# EAGLE design e-programmer-alt (EAGLE 6.1)
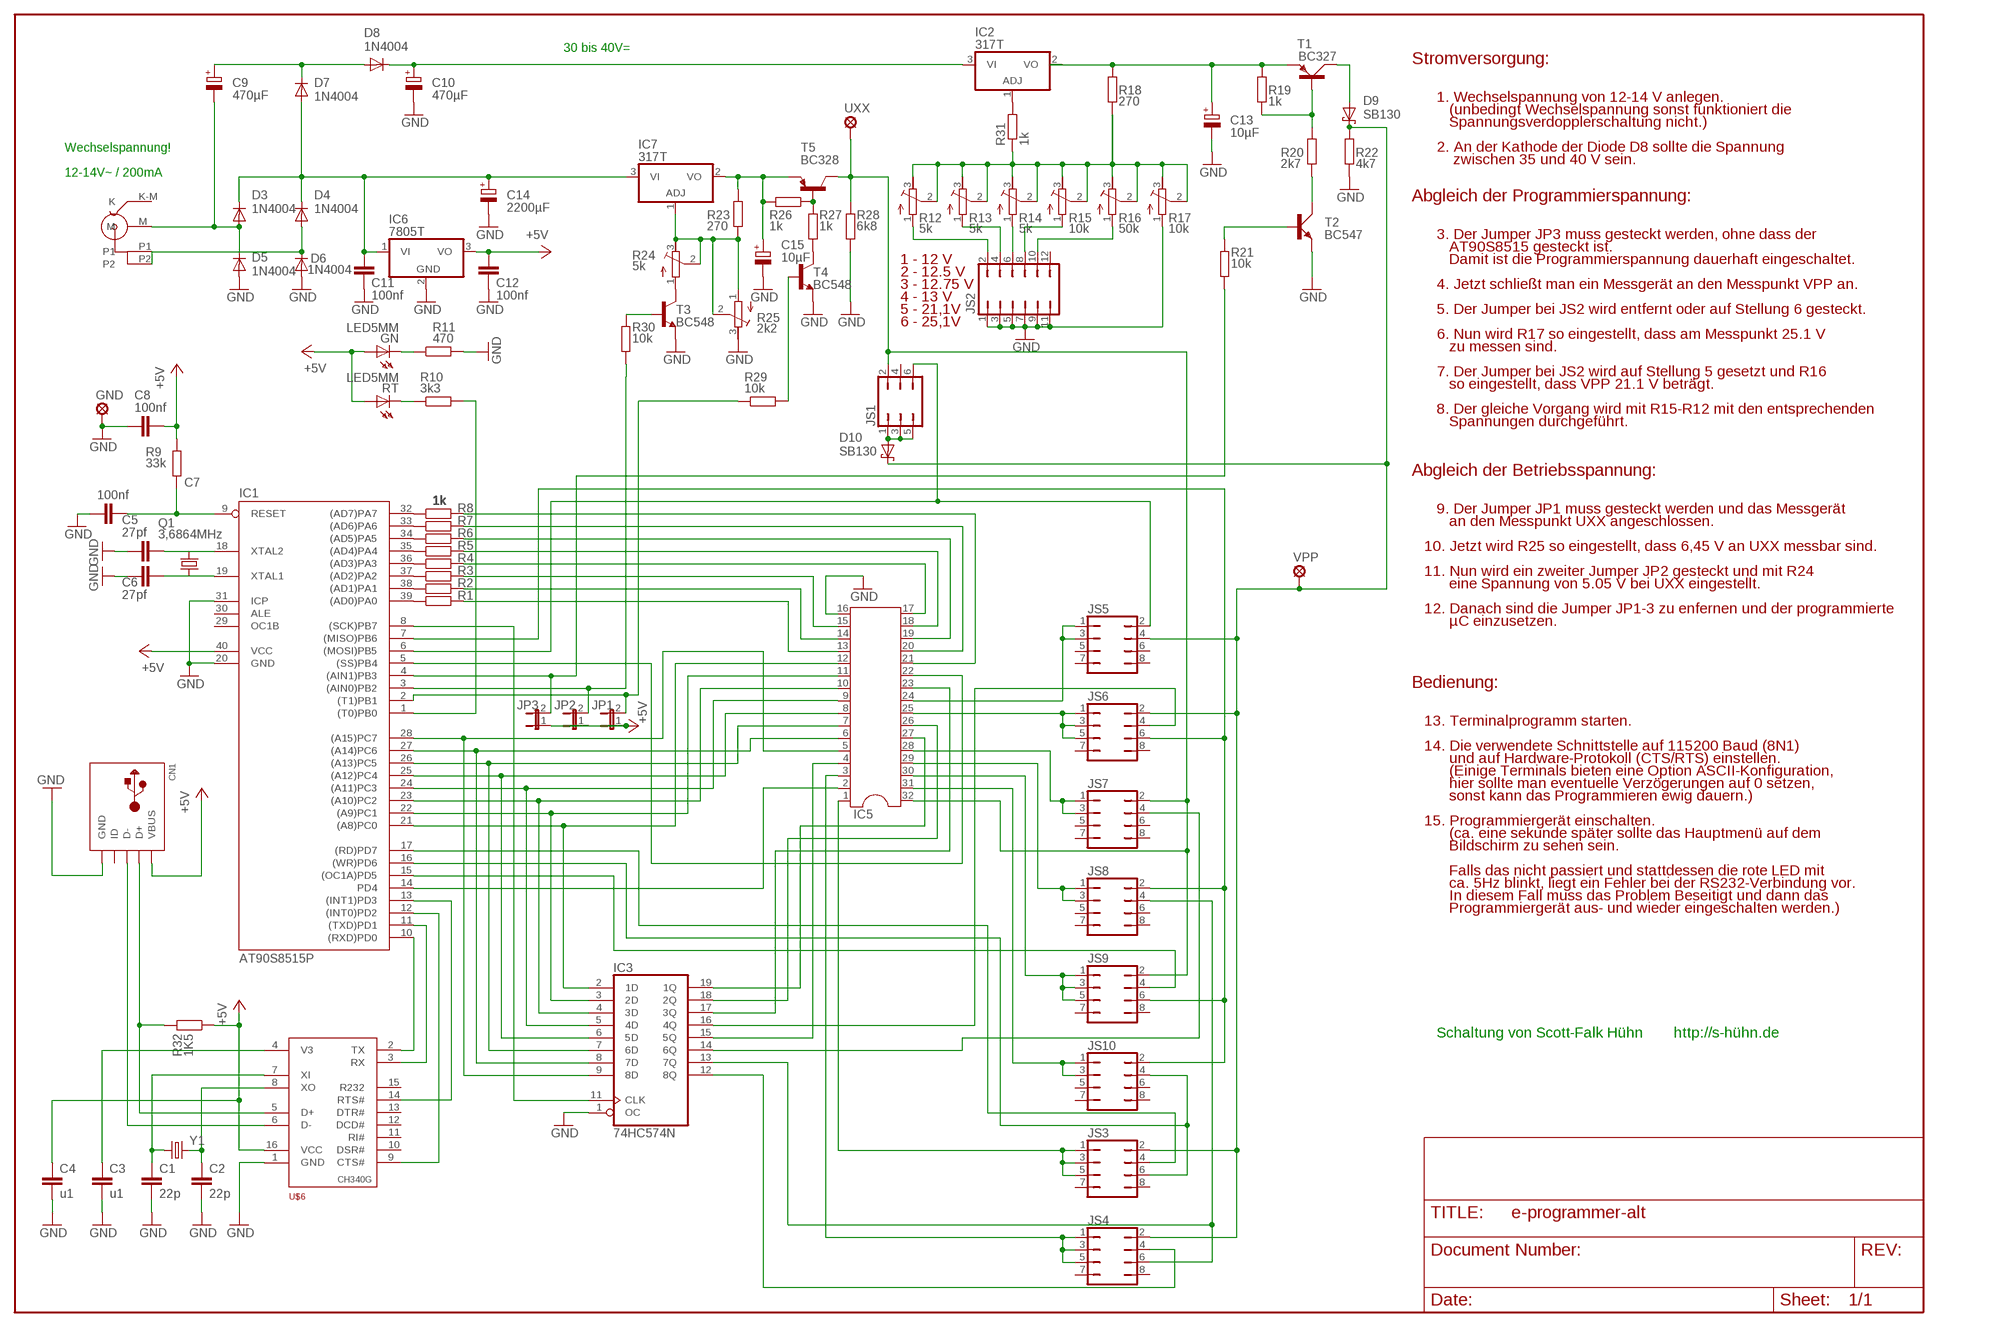
[diagram p0: schematic, sheet 1]

## Parts
BU1  KLIN_BU  [KLIN_BU]
C1  22p  C-EU025-025X050  [C025-025X050]
C2  22p  C-EU025-025X050  [C025-025X050]
C3  u1  C-EU025-025X050  [C025-025X050]
C4  u1  C-EU025-025X050  [C025-025X050]
C5  27pf  C-EU025-024X044  [C025-024X044]
C6  27pf  C-EU025-024X044  [C025-024X044]
C7  100nf  C-EU025-024X044  [C025-024X044]
C8  100nf  C-EU025-024X044  [C025-024X044]
C9  470µF  CPOL-EUE3.5-10  [E3,5-10]
C10  470µF  CPOL-EUE5-13  [E5-13]
C11  100nf  C-EU025-024X044  [C025-024X044]
C12  100nf  C-EU025-024X044  [C025-024X044]
C13  10µF  CPOL-EUE2.5-5  [E2,5-5]
C14  2200µF  CPOL-EUE7.5-16  [E7,5-16]
C15  10µF  CPOL-EUE5-5  [E5-5]
CN1  USBTHM  [USB-MINIB-THM]
D3  1N4004  [DO41-10]
D4  1N4004  [DO41-10]
D5  1N4004  [DO41-10]
D6  1N4004  [DO41-10]
D7  1N4004  [DO41-10]
D8  1N4004  [DO41-10]
D9  SB130  SCHOTTKY-DIODEDO35-7  [DO35-7]
D10  SB130  SCHOTTKY-DIODEDO35-7  [DO35-7]
GN  LED5MM  [LED5MM]
GND  LSP10  [LSP10]
IC1  AT90S8515P  [DIL40]
IC2  317T  [TO220H]
IC3  74HC574N  [DIL20]
IC5  DIL32  [DIL32]
IC6  7805T  [TO220H]
IC7  317T  [TO220H]
JP1  JP1E  [JP1]
JP2  JP1E  [JP1]
JP3  JP1E  [JP1]
JS1  JP3Q  [JP3Q]
JS2  JP6Q  [JP6Q]
JS3  JP4Q  [JP4Q]
JS4  JP4Q  [JP4Q]
JS5  JP4Q  [JP4Q]
JS6  JP4Q  [JP4Q]
JS7  JP4Q  [JP4Q]
JS8  JP4Q  [JP4Q]
JS9  JP4Q  [JP4Q]
JS10  JP4Q  [JP4Q]
Q1  3,6864MHz  HC49U-V  [HC49U-V]
R1  1k  R-EU_0207/7  [0207/7]
R2  1k  R-EU_0207/7  [0207/7]
R3  1k  R-EU_0207/7  [0207/7]
R4  1k  R-EU_0207/7  [0207/7]
R5  1k  R-EU_0207/7  [0207/7]
R6  1k  R-EU_0207/7  [0207/7]
R7  1k  R-EU_0207/7  [0207/7]
R8  1k  R-EU_0207/7  [0207/7]
R9  33k  R-EU_0204/7  [0204/7]
R10  3k3  R-EU_0204/7  [0204/7]
R11  470  R-EU_0204/7  [0204/7]
R12  5k  R-TRIMM3296Y  [RTRIM3296Y]
R13  5k  R-TRIMM3296Y  [RTRIM3296Y]
R14  5k  R-TRIMM3296Y  [RTRIM3296Y]
R15  10k  R-TRIMM3296Y  [RTRIM3296Y]
R16  50k  R-TRIMM3296Y  [RTRIM3296Y]
R17  10k  R-TRIMM3296Y  [RTRIM3296Y]
R18  270  R-EU_0207/7  [0207/7]
R19  1k  R-EU_0207/7  [0207/7]
R20  2k7  R-EU_0207/7  [0207/7]
R21  10k  R-EU_0207/7  [0207/7]
R22  4k7  R-EU_0207/7  [0207/7]
R23  270  R-EU_0207/7  [0207/7]
R24  5k  R-TRIMM3296Y  [RTRIM3296Y]
R25  2k2  R-TRIMM3296Y  [RTRIM3296Y]
R26  1k  R-EU_0207/7  [0207/7]
R27  1k  R-EU_0207/7  [0207/7]
R28  6k8  R-EU_0207/7  [0207/7]
R29  10k  R-EU_0207/7  [0207/7]
R30  10k  R-EU_0207/7  [0207/7]
R31  1k  R-EU_0207/7  [0207/7]
R32  1K5  R-EU_0204/7  [0204/7]
RT  LED5MM  [LED5MM]
T1  BC327  [SOT54A]
T2  BC547  [SOT54A]
T3  BC548  BC547  [TO92]
T4  BC548  BC547  [TO92]
T5  BC328  BC327  [TO92]
U$6  CH340G  [SO16]
UXX  LSP10  [LSP10]
VPP  LSP10  [LSP10]
Y1  CRYSTALHC49US  [HC49US]

## Nets
!CE: IC1.5((SS)PB4) IC5.22
!OE: IC1.6((MOSI)PB5) JS1.6 JS5.2
!PR: IC1.7((MISO)PB6) JS6.6 JS8.2 JS9.6 JS10.2
+5V: C4.1 C8.2 C12.1 CN1.VBUS GN.A IC1.40(VCC) IC6.3(VO) JP1.1 JP2.1 JP3.1 R9.2 R32.1 RT.A U$6.16(VCC)
A0: IC1.21((A8)PC0) IC3.2(1D) IC5.12
A1: IC1.22((A9)PC1) IC3.3(2D) IC5.11
A2: IC1.23((A10)PC2) IC3.4(3D) IC5.10
A3: IC1.24((A11)PC3) IC3.5(4D) IC5.9
A4: IC1.25((A12)PC4) IC3.6(5D) IC5.8
A5: IC1.26((A13)PC5) IC3.7(6D) IC5.7
A6: IC1.27((A14)PC6) IC3.8(7D) IC5.6
A7: IC1.28((A15)PC7) IC3.9(8D) IC5.5
A8: IC3.19(1Q) IC5.27
A9: IC3.18(2Q) IC5.26
A10: IC3.17(3Q) IC5.23
A11: IC3.16(4Q) JS6.4
A12: IC3.15(5Q) IC5.4
A13: IC3.14(6Q) JS7.4
A14: IC3.13(7Q) JS4.6 JS8.4
A15: IC3.12(8Q) JS4.4
A16: IC1.14(PD4) IC5.2
A17: IC1.15((OC1A)PD5) JS9.4
A18: IC1.16((WR)PD6) JS3.6 JS10.4
A19: IC1.17((RD)PD7) JS3.4
CTS: IC1.12((INT0)PD2) U$6.9(CTS#)
D0: IC5.13 R1.2
D1: IC5.14 R2.2
D2: IC5.15 R3.2
D3: IC5.17 R4.2
D4: IC5.18 R5.2
D5: IC5.19 R6.2
D6: IC5.20 R7.2
D7: IC5.21 R8.2
GND: C1.2 C2.2 C3.2 C4.2 C5.1 C6.1 C7.1 C8.1 C10.- C11.2 C12.2 C13.- C14.- C15.- CN1.GND D5.A D6.A GND.MP IC1.20(GND) IC1.31(ICP) IC3.1(OC) IC5.16 IC6.2(GND) JS2.1 JS2.3 JS2.5 JS2.7 JS2.9 JS2.11 R11.2 R17.1(E) R22.1 R25.3(A) R28.1 T2.E T3.1(E) T4.1(E) U$6.1(GND)
N$1: IC1.32((AD7)PA7) R8.1
N$2: IC1.33((AD6)PA6) R7.1
N$3: IC1.34((AD5)PA5) R6.1
N$4: IC1.35((AD4)PA4) R5.1
N$5: IC1.36((AD3)PA3) R4.1
N$6: IC1.37((AD2)PA2) R3.1
N$7: IC1.38((AD1)PA1) R2.1
N$8: IC1.39((AD0)PA0) R1.1
N$9: IC1.8((SCK)PB7) IC3.11(CLK)
N$10: IC1.10((RXD)PD0) U$6.2(TX)
N$11: IC1.11((TXD)PD1) U$6.3(RX)
N$12: CN1.D+ R32.2 U$6.5(D+)
N$13: CN1.D- U$6.6(D-)
N$14: C2.1 U$6.8(XO) Y1.2
N$15: C1.1 U$6.7(XI) Y1.1
N$16: C3.1 U$6.4(V3)
N$19: R10.1 RT.K(C)
N$26: GN.K(C) R11.1
N$27: IC5.3 JS4.1 JS4.3 JS4.5
N$28: C5.2 IC1.18(XTAL2) Q1.2
N$29: C6.2 IC1.19(XTAL1) Q1.1
N$30: IC5.1 JS3.1 JS3.3 JS3.5
N$31: IC5.24 JS5.1 JS5.3
N$32: C7.2 IC1.9(RESET) R9.1
N$34: IC5.25 JS6.1 JS6.3 JS6.5
N$35: JS2.2 R12.1(E)
N$36: JS2.4 R13.1(E)
N$37: IC5.28 JS7.1 JS7.3
N$38: IC5.29 JS8.1 JS8.3
N$39: C11.1 C14.+ D3.C D4.C D7.A IC6.1(VI) IC7.3(VI)
N$40: C9.+ D7.C D8.A
N$41: IC1.1((T0)PB0) R10.2
N$42: IC5.30 JS9.1 JS9.3 JS9.5
N$44: JS2.6 R14.1(E)
N$45: IC5.31 JS10.1 JS10.3
N$46: C10.+ D8.C IC2.3(VI)
N$47: JS2.8 R15.1(E)
N$48: JS2.10 R16.1(E)
N$49: R12.2(S) R12.3(A) R13.2(S) R13.3(A) R14.2(S) R14.3(A) R15.2(S) R15.3(A) R16.2(S) R16.3(A) R17.2(S) R17.3(A) R18.1 R31.1
N$50: D10.A JS1.1 JS1.3 JS1.5
N$51: D9.A T1.C
N$52: R26.1 R27.2 T5.2(B)
N$53: R27.1 T4.3(C)
N$55: IC7.1(ADJ) R23.1 R24.2(S) R24.3(A) R25.1(E) R25.2(S)
N$56: R24.1(E) T3.3(C)
N$57: C15.+ IC7.2(VO) R23.2 R26.2 T5.1(E)
N$60: R29.2 T4.2(B)
N$61: C13.+ IC2.2(VO) R18.2 R19.2 T1.E
N$62: R30.2 T3.2(B)
N$68: R19.1 R20.2 T1.B
N$69: R20.1 T2.C
N$70: R21.2 T2.B
N$71: IC2.1(ADJ) R31.2
RTS: IC1.13((INT1)PD3) U$6.14(RTS#)
UXX: IC5.32 JS1.2 JS7.2 JS9.2 R28.2 T5.3(C) UXX.MP
VCC_5/6: IC1.3((AIN0)PB2) JP2.2 R30.1
VCC_EIN: IC1.2((T1)PB1) JP1.2 R29.1
VPP: D9.C D10.C JS3.2 JS4.2 JS5.4 JS6.2 R22.2 VPP.MP
VPP_EIN: IC1.4((AIN1)PB3) JP3.2 R21.1
~1: BU1.P1 BU1.P2 D4.A D6.C
~2: BU1.M C9.- D3.A D5.C
Unconnected: BU1.K-M(K) CN1.ID IC1.29(OC1B) IC1.30(ALE) JS1.4 JS2.12 JS3.7 JS3.8 JS4.7 JS4.8 JS5.5 JS5.6 JS5.7 JS5.8 JS6.7 JS6.8 JS7.5 JS7.6 JS7.7 JS7.8 JS8.5 JS8.6 JS8.7 JS8.8 JS9.7 JS9.8 JS10.5 JS10.6 JS10.7 JS10.8 U$6.10(DSR#) U$6.11(RI#) U$6.12(DCD#) U$6.13(DTR#) U$6.15(R232)

## Notes on the sheet
- 30 bis 40V=
- Stromversorgung:
- 1. Wechselspannung von 12-14 V anlegen.
- (unbedingt Wechselspannung sonst funktioniert die
- Spannungsverdopplerschaltung nicht.)
- Wechselspannung! | 2. An der Kathode der Diode D8 sollte die Spannung
- zwischen 35 und 40 V sein.
- 12-14V~ / 200mA
- Abgleich der Programmierspannung:
- 3. Der Jumper JP3 muss gesteckt werden, ohne dass der
- AT90S8515 gesteckt ist.
- 1 - 12 V | Damit ist die Programmierspannung dauerhaft eingeschaltet.
- 2 - 12.5 V
- 3 - 12.75 V | 4. Jetzt schließt man ein Messgerät an den Messpunkt VPP an.
- 4 - 13 V
- 5 - 21,1V | 5. Der Jumper bei JS2 wird entfernt oder auf Stellung 6 gesteckt.
- 6 - 25,1V
- 6. Nun wird R17 so eingestellt, dass am Messpunkt 25.1 V
- zu messen sind.
- 7. Der Jumper bei JS2 wird auf Stellung 5 gesetzt und R16
- so eingestellt, dass VPP 21.1 V beträgt.
- 8. Der gleiche Vorgang wird mit R15-R12 mit den entsprechenden
- Spannungen durchgeführt.
- Abgleich der Betriebsspannung:
- 9. Der Jumper JP1 muss gesteckt werden und das Messgerät
- an den Messpunkt UXX angeschlossen.
- 10. Jetzt wird R25 so eingestellt, dass 6,45 V an UXX messbar sind.
- 11. Nun wird ein zweiter Jumper JP2 gesteckt und mit R24
- eine Spannung von 5.05 V bei UXX eingestellt.
- 12. Danach sind die Jumper JP1-3 zu enfernen und der programmierte
- µC einzusetzen.
- Bedienung:
- 13. Terminalprogramm starten.
- 14. Die verwendete Schnittstelle auf 115200 Baud (8N1)
- und auf Hardware-Protokoll (CTS/RTS) einstellen.
- (Einige Terminals bieten eine Option ASCII-Konfiguration,
- hier sollte man eventuelle Verzögerungen auf 0 setzen,
- sonst kann das Programmieren ewig dauern.)
- 15. Programmiergerät einschalten.
- (ca. eine sekunde später sollte das Hauptmenü auf dem
- Bildschirm zu sehen sein.
- Falls das nicht passiert und stattdessen die rote LED mit
- ca. 5Hz blinkt, liegt ein Fehler bei der RS232-Verbindung vor.
- In diesem Fall muss das Problem Beseitigt und dann das
- Programmiergerät aus- und wieder eingeschalten werden.)
- Schaltung von Scott-Falk Hühn | http://s-hühn.de

## Power pins joined to a net without a drawn wire
+5V: IC3.20(VCC)
GND: IC3.10(GND)

## Library data of the parts
BU1 = CONQUICK:KLIN_BU
C1-C8 C11 C12 = rcl:C-EU: CAPACITOR, European symbol
C9 C10 C13-C15 = rcl:CPOL-EU: POLARIZED CAPACITOR, European symbol
CN1 = adafruit:USB: USB Connectors USBMINIB - Surface Mount Female Mini-B USB Connector 4UConnector: 06564 By microbuilder.eu Thru-hole RA Female Mini-B USB Connector 4UConnector: 18732 By ladyada.net
D3-D8 = diode:1N4004: DIODE general purpose rectifier, 1 A
D9 D10 = diode:SCHOTTKY-DIODE: Schottky Diode
GN RT = led:LED5MM: LED 5 mm, round
GND UXX VPP = solpad:LSP10: SOLDER PAD drill 1.0 mm, distributor Buerklin, 12H555
IC1 = atmel:AT90S8515P: MICROCONTROLLER 8 Kbytes FLASH 512 bytes SRAM 512 bytes EEPROM UART
IC2 IC7 = linear:*317: Positive VOLTAGE REGULATOR
IC3 = 74xx-us:74*574: 8-bit D type FLIP FLOP bus driver
IC5 = dil:DIL32: SOCKET Dual In Line
IC6 = linear:78*: Positive VOLTAGE REGULATOR
JP1-JP3 = jumper:JP1E: JUMPER
JS1 = jumper:JP3Q: JUMPER
JS2 = jumper:JP6Q: JUMPER
JS3-JS10 = jumper:JP4Q: JUMPER
Q1 = crystal:HC49U-V: CRYSTAL
R1-R11 R18-R23 R26-R32 = rcl:R-EU_: RESISTOR, European symbol
R12-R17 R24 R25 = rcl:R-TRIMM: Trimm resistor
T1 = transistor-small-signal:BC327: PNP TRANSISTOR
T2 = transistor-small-signal:BC547: NPN TRANSISTOR
T3 T4 = transistor-npn:BC547: NPN TRANSISTOR
T5 = transistor-pnp:BC327: PNP TRANSISTOR
U$6 = _MY_OWN_LIB:CH340G
Y1 = SparkFun-FreqCtrl:CRYSTAL: Various standard crystals. Proven footprints. Spark Fun Electronics SKU : COM-00534

## Board
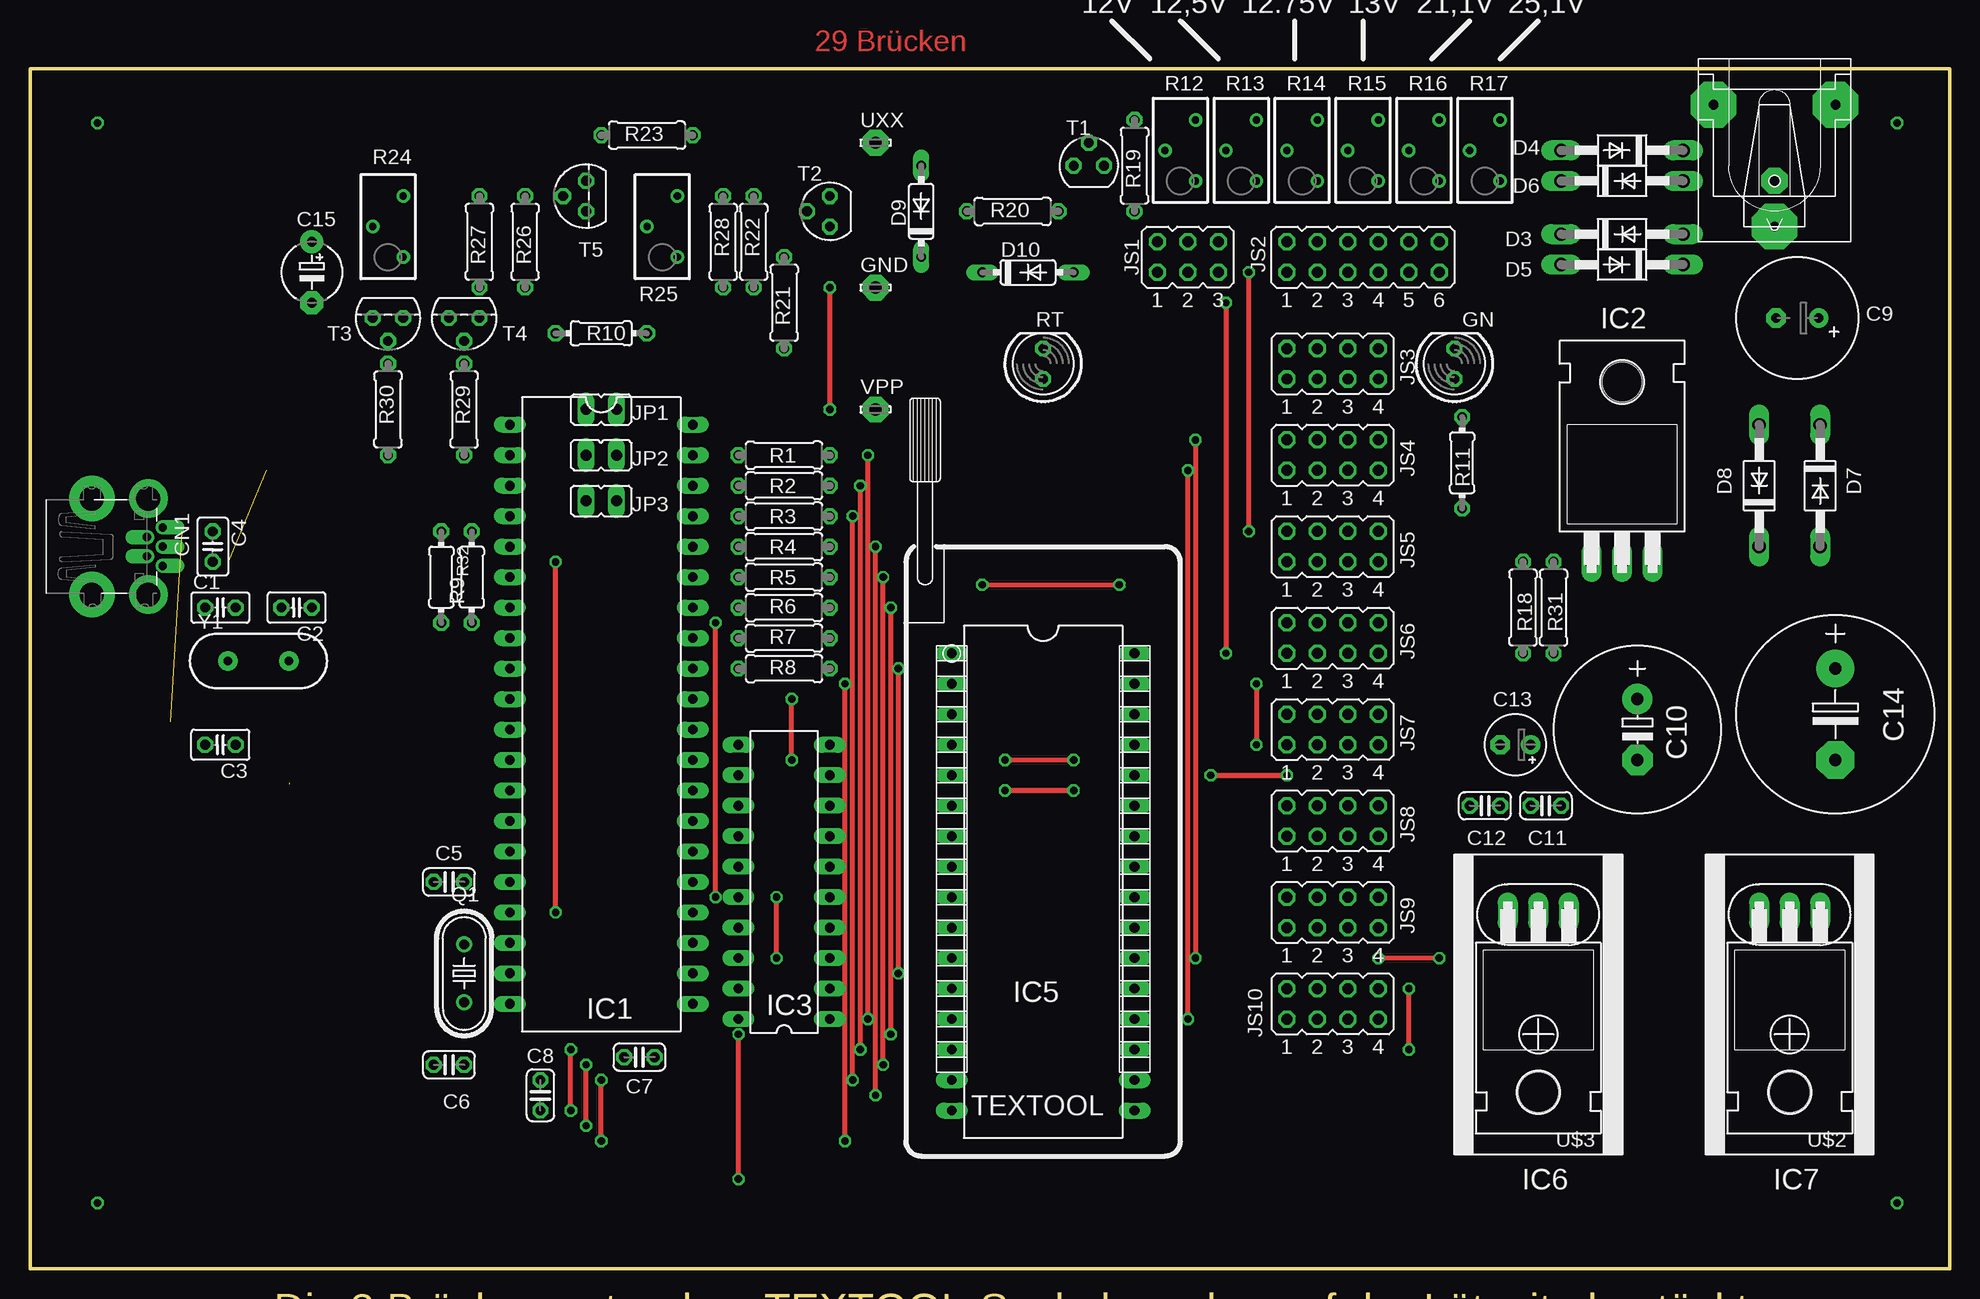
[diagram p1: board, top side]
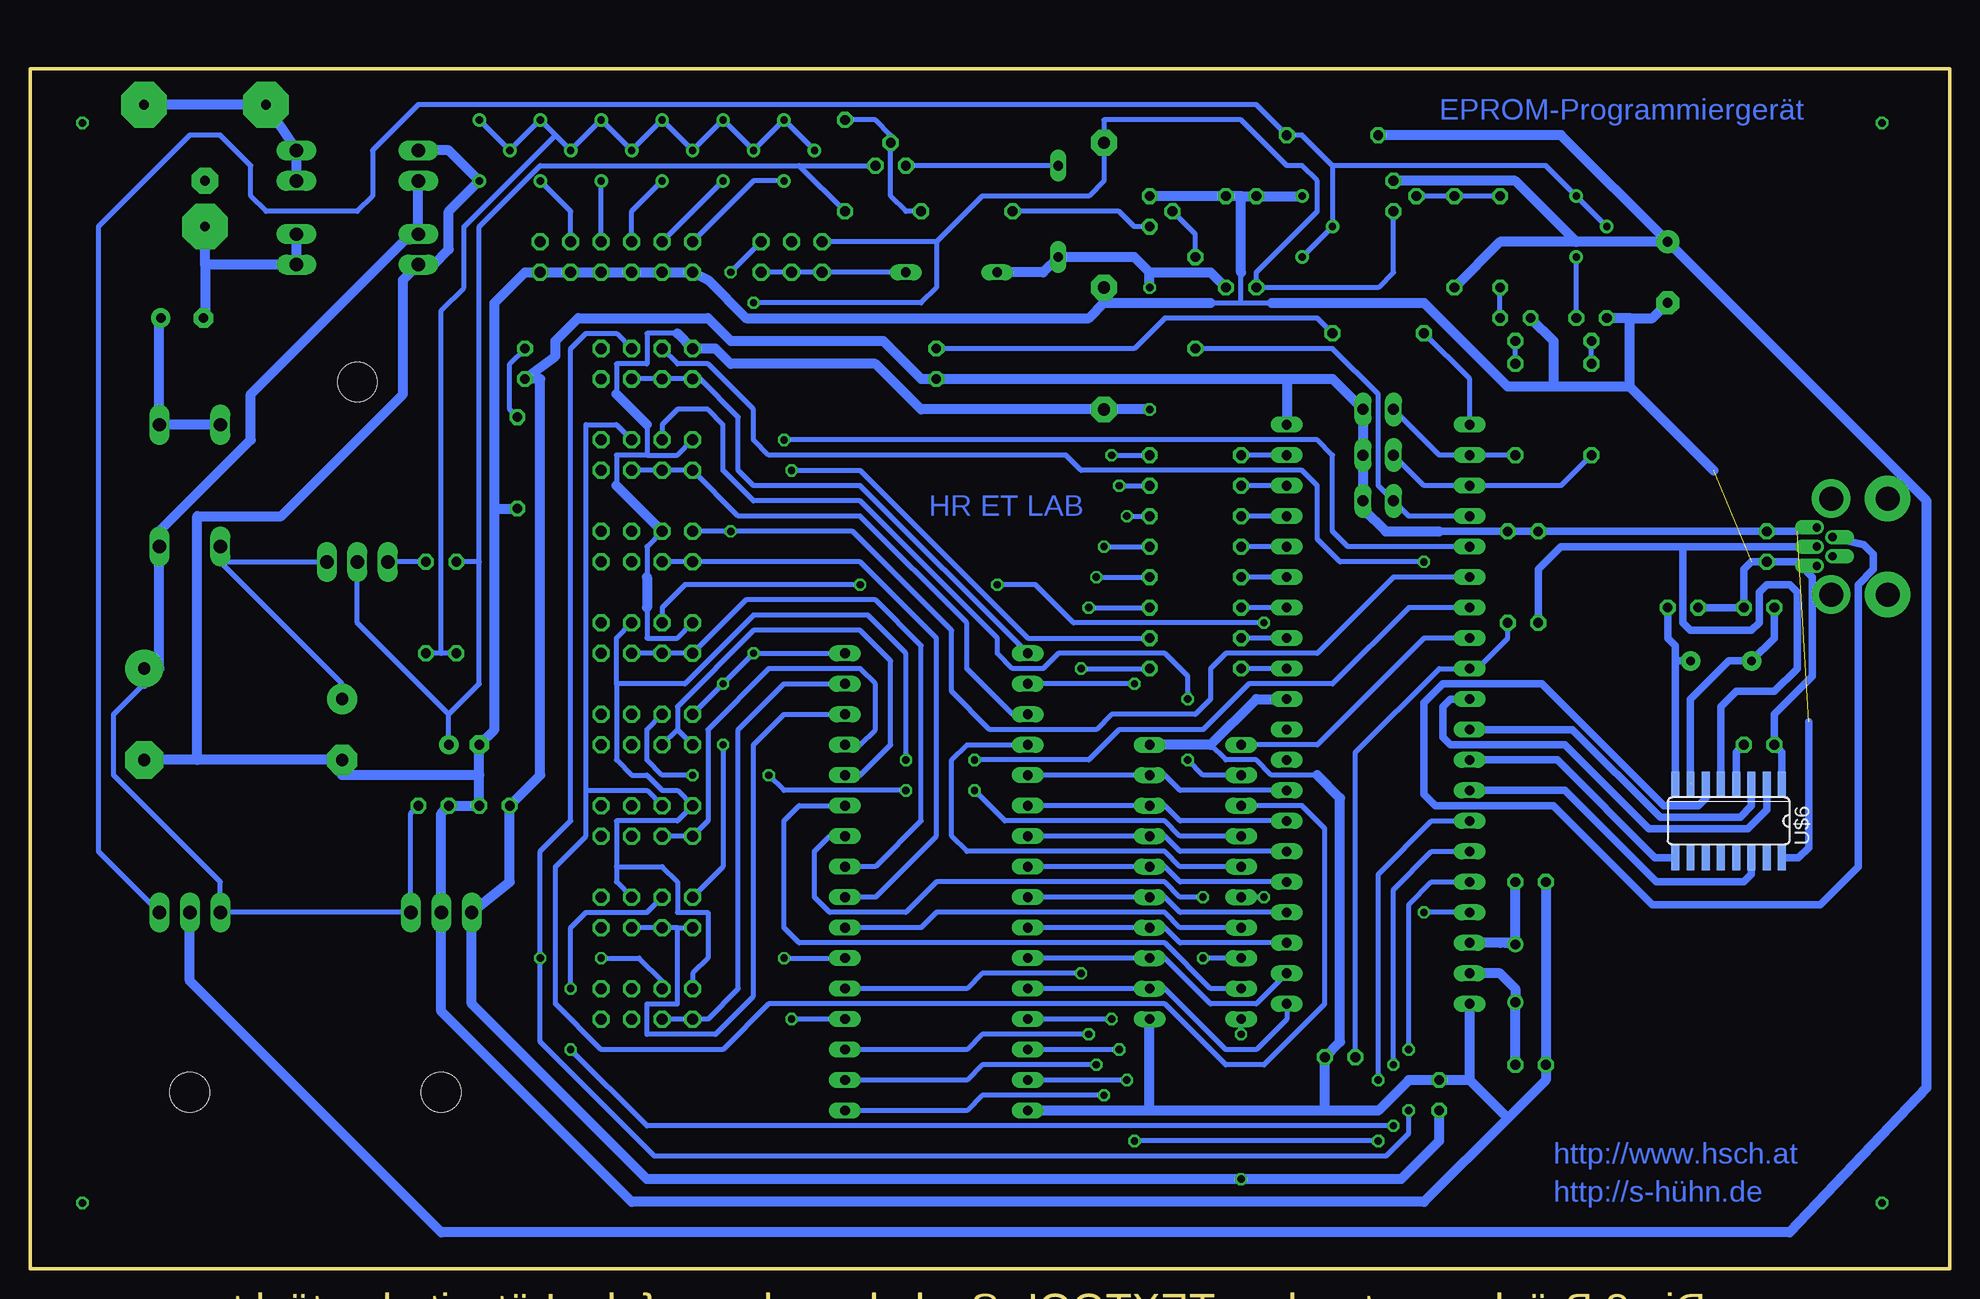
[diagram p2: board, bottom side, seen from below]

Size 160 x 100 mm. Coordinates in mm from the lower left corner, seen from the top.
Outline: 0,0 160,0 160,100 0,100 0,0
Copper layers (1*16): Top 0.035mm / dielectric 1.5mm / Bottom 0.035mm
Design rules: minimum track width 10mil, minimum drill 24mil, track to track 8mil, track to pad 8mil, pad to pad 8mil, via to via 8mil, smd to smd 8mil, copper to edge 40mil, drill to drill 8mil, minimum pad ring 10mil, minimum via ring 8mil, stop-mask expansion 4mil, vias tented up to drill 0mil, thermal gap 10mil

### Footprints (pad centres in the part's own frame; a part is rotated, then mirrored left to right if it is on the bottom)
KLIN_BU = drill 0.813 pad 2.184 octagon: K-M 3.81,0; M 7.62,0; P1 -2.54,5.08; P2 -2.54,-5.08
C025-025X050 = drill 0.813 octagon: 1 -1.27,0; 2 1.27,0
C025-024X044 = drill 0.813 octagon: 1 -1.27,0; 2 1.27,0
E3,5-10 = drill 0.813 pad 1.6: + -1.778,0 | drill 0.813 pad 1.6 octagon: - 1.778,0
E5-13 = drill 1.016 pad 2.54: + -2.54,0 | drill 1.016 pad 2.54 octagon: - 2.54,0
E2,5-5 = drill 0.813 pad 1.6: + -1.27,0 | drill 0.813 pad 1.6 octagon: - 1.27,0
E7,5-16 = drill 1.016 pad 3.15: + -3.81,0 | drill 1.016 pad 3.15 octagon: - 3.81,0
E5-5 = drill 0.813 pad 1.905: + -2.54,0 | drill 0.813 pad 1.905 octagon: - 2.54,0
USB-MINIB-THM = drill 0.7 offset: D+ 0,9.8; D- -0.8,8.5; GND 1.6,9.8; ID 0.8,8.5; VBUS -1.6,9.8 | drill 2 pad 3.81: GND1 -4,3.9; GND4 4,3.9 | drill 2 pad 3.2: GND2 -4,8.6; GND3 4,8.6
DO41-10 = drill 1.118 long: A 5.08,0; C -5.08,0
DO35-7 = drill 0.813 long: A 3.81,0; C -3.81,0
LED5MM = drill 0.813 octagon: A -1.27,0; K 1.27,0
LSP10 = drill 1.016 pad 2.159 octagon: MP 0,0
DIL40 = drill 0.813 long: 1 -24.13,-7.62; 2 -21.59,-7.62; 3 -19.05,-7.62; 4 -16.51,-7.62; 5 -13.97,-7.62; 6 -11.43,-7.62; 7 -8.89,-7.62; 8 -6.35,-7.62; 9 -3.81,-7.62; 10 -1.27,-7.62; 11 1.27,-7.62; 12 3.81,-7.62; 13 6.35,-7.62; 14 8.89,-7.62; 15 11.43,-7.62; 16 13.97,-7.62; 17 16.51,-7.62; 18 19.05,-7.62; 19 21.59,-7.62; 20 24.13,-7.62; 21 24.13,7.62; 22 21.59,7.62; 23 19.05,7.62; 24 16.51,7.62; 25 13.97,7.62; 26 11.43,7.62; 27 8.89,7.62; 28 6.35,7.62; 29 3.81,7.62; 30 1.27,7.62; 31 -1.27,7.62; 32 -3.81,7.62; 33 -6.35,7.62; 34 -8.89,7.62; 35 -11.43,7.62; 36 -13.97,7.62; 37 -16.51,7.62; 38 -19.05,7.62; 39 -21.59,7.62; 40 -24.13,7.62
TO220H = drill 1.118 long: 1 -2.54,-10.16; 2 0,-10.16; 3 2.54,-10.16 | hole 3.302: 0,4.826
DIL20 = drill 0.813 long: 1 -11.43,-3.81; 2 -8.89,-3.81; 3 -6.35,-3.81; 4 -3.81,-3.81; 5 -1.27,-3.81; 6 1.27,-3.81; 7 3.81,-3.81; 8 6.35,-3.81; 9 8.89,-3.81; 10 11.43,-3.81; 11 11.43,3.81; 12 8.89,3.81; 13 6.35,3.81; 14 3.81,3.81; 15 1.27,3.81; 16 -1.27,3.81; 17 -3.81,3.81; 18 -6.35,3.81; 19 -8.89,3.81; 20 -11.43,3.81
DIL32 = drill 0.813 long: 1 -19.05,-7.62; 2 -16.51,-7.62; 3 -13.97,-7.62; 4 -11.43,-7.62; 5 -8.89,-7.62; 6 -6.35,-7.62; 7 -3.81,-7.62; 8 -1.27,-7.62; 9 1.27,-7.62; 10 3.81,-7.62; 11 6.35,-7.62; 12 8.89,-7.62; 13 11.43,-7.62; 14 13.97,-7.62; 15 16.51,-7.62; 16 19.05,-7.62; 17 19.05,7.62; 18 16.51,7.62; 19 13.97,7.62; 20 11.43,7.62; 21 8.89,7.62; 22 6.35,7.62; 23 3.81,7.62; 24 1.27,7.62; 25 -1.27,7.62; 26 -3.81,7.62; 27 -6.35,7.62; 28 -8.89,7.62; 29 -11.43,7.62; 30 -13.97,7.62; 31 -16.51,7.62; 32 -19.05,7.62
JP1 = drill 0.914 long: 1 0,-1.27; 2 0,1.27
JP3Q = drill 0.914 octagon: 1 -2.54,-1.27; 2 -2.54,1.27; 3 0,-1.27; 4 0,1.27; 5 2.54,-1.27; 6 2.54,1.27
JP6Q = drill 0.914 octagon: 1 -6.35,-1.27; 2 -6.35,1.27; 3 -3.81,-1.27; 4 -3.81,1.27; 5 -1.27,-1.27; 6 -1.27,1.27; 7 1.27,-1.27; 8 1.27,1.27; 9 3.81,-1.27; 10 3.81,1.27; 11 6.35,-1.27; 12 6.35,1.27
JP4Q = drill 0.914 octagon: 1 -3.81,-1.27; 2 -3.81,1.27; 3 -1.27,-1.27; 4 -1.27,1.27; 5 1.27,-1.27; 6 1.27,1.27; 7 3.81,-1.27; 8 3.81,1.27
HC49U-V = drill 0.813: 1 -2.413,0; 2 2.413,0
0207/7 = drill 0.813 octagon: 1 -3.81,0; 2 3.81,0
0204/7 = drill 0.813 octagon: 1 -3.81,0; 2 3.81,0
RTRIM3296Y = drill 0.61: 1 1.27,-2.54; 2 -1.27,0; 3 1.27,2.54
SOT54A = drill 0.813 octagon: B 0,1.905; C -1.27,0; E 1.27,0
TO92 = drill 0.813 octagon: 1 1.27,0; 2 0,1.905; 3 -1.27,0
SO16 = smd 2.032 x 0.66: 1 -0.533,6.985; 2 -0.533,5.715; 3 -0.533,4.445; 4 -0.533,3.175; 5 -0.533,1.905; 6 -0.533,0.635; 7 -0.533,-0.635; 8 -0.533,-1.905; 9 5.613,-1.905; 10 5.613,-0.635; 11 5.613,0.635; 12 5.613,1.905; 13 5.613,3.175; 14 5.613,4.445; 15 5.613,5.715; 16 5.613,6.985
HC49US = drill 0.7 pad 1.651: 1 -2.54,0; 2 2.54,0

### Placement (x,y rotation side)
BU1  145.41,94.45 270 top
C1  15.87,55.08 0 top
C2  22.22,55.08 180 top
C3  15.87,43.65 180 top
C4  15.24,60.16 270 top
C5  34.92,32.22 0 top
C6  34.92,16.98 0 top
C7  50.8,17.61 180 top
C8  42.54,14.44 270 top
C9  147.31,79.21 180 top
C10  133.98,44.92 270 top
C11  126.36,38.57 180 top
C12  121.28,38.57 0 top
C13  123.82,43.65 180 top
C14  150.49,46.19 270 top
C15  23.49,83.02 270 top
CN1  1.27,60.16 270 top
D3  132.71,86.19 0 top
D4  132.71,90.64 0 top
D5  132.71,83.66 180 top
D6  132.71,93.18 180 top
D7  149.22,65.24 270 top
D8  144.14,65.24 90 top
D9  74.29,88.1 90 top
D10  83.18,83.02 0 top
GN  118.74,75.4 90 top
GND  70.48,81.75 0 top
IC1  47.62,46.19 270 top
IC2  132.71,69.05 0 top
IC3  62.86,32.22 90 top
IC5  84.45,32.22 270 top
IC6  125.72,19.52 180 top
IC7  146.68,19.52 180 top
JP1  47.62,71.59 90 top
JP2  47.62,67.78 90 top
JP3  47.62,63.97 90 top
JS1  96.52,84.29 0 top
JS2  111.12,84.29 0 top
JS3  108.58,75.4 0 top
JS4  108.58,67.78 0 top
JS5  108.58,60.16 0 top
JS6  108.58,52.54 0 top
JS7  108.58,44.92 0 top
JS8  108.58,37.3 0 top
JS9  108.58,29.68 0 top
JS10  108.58,22.06 0 top
Q1  36.19,24.6 90 top
R1  62.86,67.78 0 top
R2  62.86,65.24 0 top
R3  62.86,62.7 0 top
R4  62.86,60.16 0 top
R5  62.86,57.62 0 top
R6  62.86,55.08 0 top
R7  62.86,52.54 0 top
R8  62.86,50 0 top
R9  36.83,57.62 90 top
R10  47.62,77.94 180 top
R11  119.38,67.14 270 top
R12  95.88,93.18 0 top
R13  100.96,93.18 0 top
R14  106.04,93.18 0 top
R15  111.12,93.18 0 top
R16  116.2,93.18 0 top
R17  121.28,93.18 0 top
R18  124.45,55.08 90 top
R19  92.07,91.91 270 top
R20  81.91,88.1 0 top
R21  62.86,80.48 90 top
R22  60.32,85.56 270 top
R23  51.43,94.45 180 top
R24  29.84,86.83 0 top
R25  52.7,86.83 0 top
R26  41.27,85.56 270 top
R27  37.46,85.56 90 top
R28  57.78,85.56 270 top
R29  36.19,71.59 90 top
R30  29.84,71.59 90 top
R31  126.99,55.08 90 top
R32  34.29,57.62 270 top
RT  84.45,75.4 90 top
T1  88.26,91.91 0 top
T2  66.67,88.1 90 top
T3  29.84,79.21 180 top
T4  36.19,79.21 180 top
T5  46.35,89.37 90 top
U$1  [SOCKEL]  84.45,33.49 180 top
U$2  [SK12/25]  146.68,24.6 90 top
U$3  [SK12/25]  125.72,24.6 90 top
U$4  [LETTER_P]  203.83,-49.06 90 top  (outside the outline)
U$5  [DOCFIELD]  102.23,-49.06 0 top  (outside the outline)
U$6  20.95,39.84 270 bottom
UXX  70.48,93.81 0 top
VPP  70.48,71.59 0 top
Y1  19.04,50.63 0 top

### Tracks (layer width: path | path; a pad name or v marks a point on that pad's centre or on a via)
!CE  (via drill 0.61)
  Top 0.406: v97.15,69.05 v97.15,25.87
  Bottom 0.406: v97.15,69.05 52.7,69.05 51.43,67.78 51.43,61.43 50.16,60.16 IC1.5 | v97.15,25.87 IC5.22
!OE  (via drill 0.61)
  Top 0.406: v101.59,61.43 v101.59,83.02
  Bottom 0.406: JS5.2 v101.59,61.43 91.44,61.43 83.18,53.17 83.18,48.09 80,44.92 71.11,44.92 69.84,46.19 62.86,46.19 61.59,47.46 61.59,50 60.32,51.27 52.7,51.27 46.35,57.62 IC1.6 | v101.59,83.02 JS1.6
!PR  (via drill 0.61)
  Top 0.406: v81.27,42.38 v86.99,42.38
  Bottom 0.406: JS9.6 111.12,32.22 111.12,33.49 | 111.12,33.49 111.12,37.3 106.04,37.3 JS8.2 106.04,39.84 107.31,39.84 108.58,41.11 109.85,41.11 111.12,42.38 111.12,48.73 | JS6.6 111.12,52.54 111.12,48.73 | JS10.2 104.77,24.6 103.5,25.87 103.5,29.68 106.04,29.68 106.04,32.22 107.31,33.49 111.12,33.49 | v81.27,42.38 71.75,42.38 69.21,44.92 62.23,44.92 58.41,48.73 51.43,48.73 45.08,55.08 IC1.7 | v86.99,42.38 86.99,51.27 90.16,54.45 99.69,54.45 105.41,48.73 111.12,48.73
+5V  (via drill 0.61)  (1 unrouted)
  Top 0.406: v59.05,7.46 v59.05,19.52
  Bottom 0.406: v59.05,19.52 IC3.20
  Bottom 0.61: 42.54,61.43 R9.2 R32.1 C4.1 12.7,61.43 12.37,61.76 CN1.VBUS | U$6.16 12.59,34.23 11.74,35.08 11.74,45.55
  Bottom 0.813: 55.24,74.13 51.43,74.13 JP1.1 JP2.1 JP3.1 48.89,63.34 46.98,61.43 42.54,61.43 | 55.24,74.13 RT.A 85.72,74.13 88.89,77.3 101.59,77.3 103.5,79.21 114.3,79.21 116.2,77.3 116.2,76.03 GN.A 117.47,74.13 117.47,41.11 C12.1 120.01,32.22 IC6.3 123.19,22.06 108.58,7.46 v59.05,7.46 45.72,7.46 42.54,10.63 C8.2 | 55.24,74.13 IC1.40
A0
  Bottom 0.406: IC1.21 55.24,20.79 57.78,18.25 60.32,18.25 65.4,23.33 IC3.2 IC5.12
A1
  Bottom 0.406: IC1.22 57.78,22.06 61.59,22.06 65.4,25.87 IC3.3 IC5.11
A2
  Bottom 0.406: IC1.23 64.13,27.14 65.4,28.41 IC3.4 IC5.10
A3
  Bottom 0.406: IC1.24 64.13,29.68 65.4,30.95 IC3.5 IC5.9
A4
  Bottom 0.406: IC1.25 64.13,32.22 65.4,33.49 IC3.6 IC5.8
A5
  Bottom 0.406: IC1.26 64.13,34.76 65.4,36.03 IC3.7 IC5.7
A6
  Bottom 0.406: IC1.27 64.13,37.3 65.4,38.57 IC3.8 IC5.6
A7
  Bottom 0.406: IC1.28 64.13,39.84 65.4,41.11 IC3.9 IC5.5
A8
  Bottom 0.406: IC3.19 61.59,23.33 65.4,27.14 95.88,27.14 97.15,28.41 97.15,37.3 95.88,38.57 IC5.27
A9  (via drill 0.61)
  Top 0.406: v62.23,25.87 v62.23,30.95
  Bottom 0.406: IC5.26 93.34,36.03 94.61,34.76 94.61,30.95 93.34,29.68 86.99,29.68 84.45,32.22 65.4,32.22 64.13,30.95 v62.23,30.95 | IC3.18 v62.23,25.87
A10
  Bottom 0.406: IC3.17 64.13,28.41 65.4,29.68 84.45,29.68 85.72,28.41 IC5.23
A11  (via drill 0.61)
  Top 0.406: v79.37,56.98 v90.8,56.98 | v57.15,30.95 v57.15,53.81
  Bottom 0.406: JS6.4 107.31,55.08 105.41,56.98 v90.8,56.98 | v79.37,56.98 76.19,56.98 73.02,53.81 v57.15,53.81 | v57.15,30.95 IC3.16
A12
  Bottom 0.406: IC3.15 64.13,33.49 65.4,34.76 81.91,34.76 83.18,36.03 83.18,42.38 81.91,43.65 IC5.4
A13  (via drill 0.61)
  Top 0.406: v81.27,39.84 v86.99,39.84 | v98.42,41.11 v104.77,41.11
  Bottom 0.406: IC3.14 64.13,36.03 65.4,37.3 78.73,37.3 v81.27,39.84 | v86.99,39.84 97.15,39.84 v98.42,41.11 | v104.77,41.11 107.31,41.11 108.58,42.38 108.58,44.92 JS7.4
A14
  Bottom 0.406: 113.66,39.84 113.66,36.03 116.2,33.49 116.2,22.06 112.39,18.25 102.23,18.25 98.42,22.06 65.4,22.06 60.32,16.98 57.15,16.98 52.07,22.06 52.07,36.66 53.97,38.57 IC3.13 | 113.66,39.84 108.58,39.84 JS8.4 | JS4.6 111.12,70.32 113.66,70.32 113.66,39.84
A15  (via drill 0.61)
  Top 0.406: v63.5,42.38 v63.5,47.46
  Bottom 0.406: JS4.4 107.31,70.32 106.04,71.59 103.5,71.59 102.23,70.32 102.23,66.51 99.69,63.97 90.8,63.97 79.37,52.54 79.37,51.27 78.1,50 75.56,50 74.29,51.27 65.4,51.27 63.5,49.37 v63.5,47.46 | IC3.12 62.23,41.11 v63.5,42.38
A16  (via drill 0.61)
  Top 0.406: v47.62,10.63 v47.62,15.71 | v67.94,10.63 v67.94,48.73
  Bottom 0.406: v47.62,15.71 47.62,32.85 43.18,37.3 IC1.14 | v47.62,10.63 v67.94,10.63 | v67.94,48.73 IC5.2
A17  (via drill 0.61)
  Top 0.406: v46.35,11.9 v46.35,16.98 | v114.93,18.25 v114.93,23.33
  Bottom 0.406: IC1.15 43.18,34.76 46.35,31.58 v46.35,16.98 | JS9.4 108.58,29.68 113.66,29.68 114.93,28.41 v114.93,23.33 | v114.93,18.25 108.58,11.9 v46.35,11.9
A18  (via drill 0.61)
  Top 0.406: v117.47,25.87 v112.39,25.87 | v45.08,13.17 v45.08,18.25
  Bottom 0.406: JS3.6 111.12,77.94 113.66,77.94 114.93,76.67 114.93,37.3 117.47,34.76 v117.47,25.87 117.47,18.88 107.94,9.36 46.98,9.36 45.08,11.27 v45.08,13.17 | v112.39,25.87 109.21,25.87 107.31,23.96 JS10.4 | IC1.16 43.18,32.22 45.08,30.31 v45.08,18.25
A19  (via drill 0.61)
  Top 0.406: v43.81,29.68 v43.81,58.89
  Bottom 0.406: JS3.4 106.04,75.4 103.5,75.4 99.69,71.59 99.69,69.05 98.42,67.78 73.66,67.78 72.38,66.51 53.97,66.51 52.7,65.24 52.7,60.8 50.8,58.89 v43.81,58.89 | IC1.17 v43.81,29.68
CTS
  Bottom 0.61: U$6.9 24.54,34.23 32.7,42.38 IC1.12
D0  (via drill 0.61)
  Top 0.406: v69.84,20.79 v69.84,67.78
  Bottom 0.406: v69.84,67.78 R1.2 | v69.84,20.79 IC5.13
D1  (via drill 0.61)
  Top 0.406: v69.21,18.25 v69.21,65.24
  Bottom 0.406: v69.21,18.25 IC5.14 | v69.21,65.24 R2.2
D2  (via drill 0.61)
  Top 0.406: v68.57,15.71 v68.57,62.7
  Bottom 0.406: v68.57,62.7 R3.2 | v68.57,15.71 IC5.15
D3  (via drill 0.61)
  Top 0.406: v70.48,14.44 v70.48,60.16
  Bottom 0.406: v70.48,60.16 R4.2 | v70.48,14.44 80.64,14.44 81.91,13.17 IC5.17
D4  (via drill 0.61)
  Top 0.406: v71.11,16.98 v71.11,57.62
  Bottom 0.406: v71.11,16.98 80.64,16.98 81.91,15.71 IC5.18 | v71.11,57.62 R5.2
D5  (via drill 0.61)
  Top 0.406: v71.75,19.52 v71.75,55.08
  Bottom 0.406: v71.75,55.08 R6.2 | v71.75,19.52 80.64,19.52 81.91,18.25 IC5.19
D6  (via drill 0.61)
  Top 0.406: v96.52,20.79 v96.52,66.51
  Bottom 0.406: IC5.20 v96.52,20.79 | v96.52,66.51 90.8,66.51 76.83,52.54 R7.2
D7  (via drill 0.61)
  Top 0.406: v72.38,24.6 v72.38,50
  Bottom 0.406: v72.38,50 R8.2 | v72.38,24.6 80.64,24.6 81.91,23.33 IC5.21
GND  (1 unrouted)
  Bottom 0.406: IC5.16 75.56,13.17 | 52.7,41.11 56.51,41.11 57.78,42.38 60.32,42.38 61.59,43.65 | 59.05,80.48 59.05,83.02 | 61.59,80.48 59.05,80.48 | 59.05,80.48 56.51,80.48
  Bottom 0.61: CN1.GND 12.37,58.56 | 12.37,58.56 12.54,58.73 12.7,58.89 C4.2 16.5,58.89 17.14,58.25 C1.2 C2.2 | U$6.1 13.97,43.02 C3.2 14.6,46.19 11.43,49.37 11.43,57.62 12.37,58.56
  Bottom 0.813: 122.55,41.11 C12.2 C11.2 125.72,37.94 IC6.2 125.72,21.42 109.85,5.55 43.81,5.55 36.83,12.54 | 122.55,41.11 C13.- 121.28,44.92 121.28,63.34 | 122.55,41.11 133.98,41.11 C10.- 146.04,42.38 | 146.04,42.38 C14.- | 146.04,42.38 146.04,62.7 139.06,62.7 128.9,72.86 128.9,82.39 D5.A 126.36,83.66 125.09,84.92 125.09,88.1 R17.1 125.09,93.18 D6.A | IC3.10 61.59,43.65 57.78,47.46 IC1.31 | 52.07,13.17 47.62,13.17 45.08,15.71 C8.1 40,15.71 | 52.7,41.11 50.8,39.2 50.8,18.88 C7.1 52.07,13.17 | R25.3 R28.1 59.05,89.37 | 59.05,89.37 R22.1 T2.E | 70.48,80.48 71.75,79.21 100.32,79.21 103.5,82.39 JS2.1 JS2.3 JS2.5 JS2.7 JS2.9 JS2.11 118.74,83.02 121.28,80.48 121.28,63.34 | 66.67,13.17 IC3.1 | 66.67,13.17 IC5.16 | 52.07,13.17 66.67,13.17 | 70.48,80.48 GND.MP | 121.28,63.34 R11.2 | 59.05,83.02 59.05,89.37 | 70.48,80.48 61.59,80.48 | 56.51,80.48 43.81,80.48 36.83,73.5 33.02,73.5 | 40,15.71 IC1.20 | 36.83,12.54 33.65,15.71 C6.1 C5.1 | 40,15.71 36.83,12.54 | 26.66,73.5 33.02,73.5 | T4.1 33.02,77.3 33.02,73.5 | 19.68,66.51 26.66,73.5 | 26.66,73.5 26.66,79.21 | 26.66,79.21 T3.1 | 26.66,79.21 24.76,79.21 C15.-
N$1
  Bottom 0.406: IC1.32 R8.1
N$2
  Bottom 0.406: IC1.33 R7.1
N$3
  Bottom 0.406: IC1.34 R6.1
N$4
  Bottom 0.406: IC1.35 R5.1
N$5
  Bottom 0.406: IC1.36 R4.1
N$6
  Bottom 0.406: IC1.37 R3.1
N$7
  Bottom 0.406: IC1.38 R2.1
N$8
  Bottom 0.406: IC1.39 R1.1
N$9
  Bottom 0.406: IC3.11 52.7,43.65 43.81,52.54 IC1.8
N$10
  Bottom 0.61: U$6.2 15.24,38.25 16.82,36.66 25.08,36.66 32.06,43.65 41.59,43.65 42.22,44.28 42.22,46.82 41.59,47.46 IC1.10
N$11
  Bottom 0.61: U$6.3 16.5,38.57 17.46,37.62 24.12,37.62 31.43,44.92 IC1.11
N$12
  Bottom 0.61: CN1.D+ 22.22,60.16 | 22.22,60.16 32.38,60.16 34.29,58.25 R32.2 | U$6.5 19.04,46.82 17.77,48.09 14.6,48.09 12.7,50 12.7,56.35 13.33,56.98 15.24,56.98 15.87,56.35 15.87,53.81 16.5,53.17 21.58,53.17 22.22,53.81 22.22,60.16
N$13
  Bottom 0.61: CN1.D- 7.14,60.32 6.34,59.52 6.34,58.25 7.62,56.98 7.62,33.49 10.79,30.31 24.76,30.31 33.02,38.57 42.86,38.57 43.81,39.52 43.81,47.14 42.22,48.73 33.97,48.73 23.81,38.57 20.95,38.57 20.31,39.2 U$6.6
N$14
  Bottom 0.61: C2.1 23.49,52.54 22.86,51.91 22.86,50.63 | U$6.8 22.86,50.63 | Y1.2 22.86,50.63
N$15  (1 unrouted)
  Bottom 0.61: C1.1 14.6,52.54 Y1.1 18.41,50.63 21.58,47.46 21.58,40.48
N$16
  Bottom 0.61: U$6.4 17.77,43.02 C3.1
N$19
  Bottom 0.406: RT.K 67.94,76.67 65.4,79.21 52.7,79.21 R10.1
N$26
  Bottom 0.406: GN.K 120.01,75.4 120.01,71.59 R11.1
N$27
  Bottom 0.406: JS4.5 JS4.3 JS4.1 100.96,62.7 90.8,62.7 81.91,53.81 81.91,50 78.1,46.19 IC5.3
N$28
  Bottom 0.406: Q1.2 36.19,27.14
  Bottom 0.813: Q1.2 37.46,27.14 | 37.46,27.14 36.19,27.14 C5.2 | 37.46,27.14 IC1.18
N$29
  Bottom 0.813: IC1.19 37.46,24.6 36.19,23.33 Q1.1 C6.2
N$30
  Bottom 0.406: IC5.1 90.8,65.24 99.69,65.24 100.96,66.51 100.96,70.95 104.13,74.13 JS3.1 JS3.3 JS3.5
N$31
  Bottom 0.406: IC5.24 89.53,30.95 84.45,36.03 84.45,52.54 90.8,58.89 JS5.1 JS5.3
N$32
  Bottom 0.406: C7.2 49.53,43.02 42.54,50 IC1.9 39.37,50 36.83,52.54 R9.1
N$33  (via drill 0.61)
  other vias: 132.71,73.97
N$34
  Bottom 0.406: IC5.25 89.53,33.49 85.72,37.3 85.72,51.91 89.53,55.71 100.32,55.71 JS6.1 JS6.3 JS6.5
N$35
  Bottom 0.406: JS2.2 99.69,90.64 R12.1
N$36
  Bottom 0.406: JS2.4 R13.1
N$37
  Bottom 0.406: 106.04,44.92 106.04,46.82 99.69,53.17 90.8,53.17 88.26,50.63 88.26,43.65 90.8,41.11 IC5.28 | 106.04,44.92 JS7.1 | 106.04,44.92 JS7.3
N$38
  Bottom 0.406: IC5.29 90.8,43.65 89.53,44.92 89.53,48.73 90.8,50 98.42,50 103.5,44.92 103.5,37.3 JS8.1 JS8.3
N$39
  Bottom 0.406: C11.1 128.27,37.94 IC6.1 IC7.3 144.14,32.22 153.03,41.11 153.03,46.19 150.49,48.73 | C14.+ 149.22,50 | 128.9,85.56 128.27,85.56 D3.C | D7.A 149.22,61.43
  Bottom 0.813: D3.C D4.C | 149.22,50 D7.A | 149.22,61.43 141.6,69.05 141.6,72.86 128.9,85.56 | 150.49,48.73 C14.+
N$40
  Bottom 0.406: 149.22,79.21 C9.+
  Bottom 0.813: 149.22,79.21 D7.C D8.A
N$41
  Bottom 0.406: IC1.1 40,74.13 R10.2
N$42
  Bottom 0.406: 106.04,28.41 106.04,22.06 108.58,22.06 108.58,19.52 102.86,19.52 99.69,22.7 99.69,43.65 97.15,46.19 IC5.30 | 106.04,28.41 JS9.1 | 106.04,28.41 JS9.3 JS9.5
N$43  (via drill 0.61)
  other vias: 125.69,14.76
N$44
  Bottom 0.406: R14.1 109.85,88.1 JS2.6
N$45
  Bottom 0.406: IC5.31 97.15,48.73 100.96,44.92 100.96,23.33 103.5,20.79 JS10.1 JS10.3
N$46
  Bottom 0.406: 144.14,58.89 IC2.3 | 144.14,58.89 133.98,48.73 C10.+ | 144.14,58.89 D8.C
N$47
  Bottom 0.406: JS2.8 R15.1
N$48
  Bottom 0.406: JS2.10 114.93,88.1 R16.1
N$49
  Bottom 0.406: 116.2,94.45 R16.2 R15.3 R15.2 R14.3 R14.2 R13.3 R13.2 R12.3 R12.2 | 116.2,94.45 R16.3 R17.2 R17.3 | 116.2,94.45 123.82,86.83 123.82,81.75 125.72,79.84 125.72,51.27 | R18.1 125.72,51.27 | 125.72,51.27 R31.1
N$50
  Bottom 0.406: JS1.5 JS1.3 JS1.1 D10.A
N$51
  Bottom 0.406: D9.A T1.C
N$52
  Bottom 0.406: R27.2 R26.1 T5.2
N$53
  Bottom 0.406: T4.3 R27.1
N$54  (via drill 0.61)
  other vias: 146.68,14.76
N$55
  Bottom 0.406: IC7.1 154.3,34.76 154.3,86.83 146.68,94.45 144.14,94.45 141.6,91.91 141.6,89.37 140.33,88.1 132.71,88.1 131.44,89.37 131.44,93.18 127.63,96.99 57.78,96.99 R23.1 53.97,94.45 51.43,91.91 | R24.2 R24.3 33.65,91.91 51.43,91.91 | R25.1 R25.2 51.43,91.91
N$56
  Bottom 0.406: T3.3 R24.1
N$57
  Bottom 0.813: IC7.2 146.68,23.96 125.72,3.01 13.33,3.01 1.9,15.08 1.9,63.97 C15.+ | R26.2 37.46,85.56 31.11,85.56 | C15.+ 31.11,85.56 | T5.1 36.19,90.64 31.11,85.56 | R23.2 32.38,94.45 C15.+
N$58  (via drill 0.61)
  other vias: 5.63,95.47
N$59  (via drill 0.61)
  other vias: 5.63,5.47
N$60
  Bottom 0.406: R29.2 T4.2
N$61
  Bottom 0.406: IC2.2 132.71,53.81 125.09,46.19 | C13.+ 125.09,46.19 | 125.09,46.19 122.55,48.73 122.55,58.89 | 122.55,58.89 122.55,86.83 117.47,91.91 95.88,91.91 | 95.88,91.91 R19.2 | 95.88,91.91 T1.E | 122.55,58.89 R18.2
N$62
  Bottom 0.406: R30.2 T3.2
N$63  (via drill 0.61)
  other vias: 155.63,5.47
N$64  (via drill 0.61)
  other vias: 155.63,95.47
N$67  (via drill 0.61 pad 3.81)
  other vias: 145.41,86.83
N$68
  Bottom 0.406: R19.1 89.53,95.72 88.26,94.45 T1.B 88.26,89.37 86.99,88.1 R20.2
N$69
  Bottom 0.406: R20.1 69.21,88.1 67.94,86.83 T2.C
N$70
  Bottom 0.406: R21.2 62.86,86.19 T2.B
N$71
  Bottom 0.406: R31.2 IC2.1
N$72  (via drill 0.61 pad 3.81)
  other vias: 150.49,96.99
N$73  (via drill 0.61 pad 3.81)
  other vias: 140.33,96.99
RTS
  Bottom 0.61: U$6.14 16.5,32.85 17.14,32.22 24.44,32.22 32.06,39.84 IC1.13
UXX  (via drill 0.61)
  Top 0.406: v102.23,48.73 v102.23,43.65 | v99.69,80.48 v99.69,51.27
  Bottom 0.406: IC5.32 v99.69,51.27 v102.23,48.73 JS7.2 | JS9.2 102.23,33.49 v102.23,43.65 | T5.3 46.35,83.02 47.62,81.75 R28.2 57.78,83.02 52.7,88.1 52.7,90.64 53.97,91.91 55.24,91.91 59.05,95.72 70.48,95.72 UXX.MP 70.48,90.64 71.75,89.37 80.64,89.37 84.45,85.56 | 84.45,85.56 JS1.2 | 84.45,85.56 84.45,81.75 85.72,80.48 v99.69,80.48
VCC_5/6
  Bottom 0.406: R30.1 32.38,65.24 IC1.3 43.81,65.24 JP2.2
VCC_EIN
  Bottom 0.406: R29.1 IC1.2 42.54,67.78 JP1.2
VPP  (via drill 0.61)
  Top 0.406: v66.67,71.59 v66.67,81.75
  Bottom 0.406: JS5.4 108.58,60.16 108.58,57.62 | JS4.2 106.04,67.78 108.58,67.78 | 108.58,67.78 111.12,67.78 111.12,65.24 | 108.58,70.32 108.58,67.78 | 111.12,72.86 111.12,75.4 108.58,75.4 108.58,77.94 106.04,77.94 | JS6.2 106.04,52.54 108.58,52.54 108.58,55.08
  Bottom 0.813: 111.12,65.24 JS5.4 | 111.12,72.86 108.58,70.32 | 106.04,77.94 JS3.2 102.86,76.67 101.59,75.4 89.53,75.4 85.72,71.59 VPP.MP v66.67,71.59 | R22.2 61.59,83.02 66.67,83.02 | v66.67,81.75 66.67,83.02 | 66.67,83.02 67.94,84.29 D9.C 75.56,83.02 D10.C | 108.58,57.62 108.58,55.08
VPP_EIN
  Bottom 0.406: R21.1 51.43,76.67 47.62,72.86 47.62,65.24 JP3.2 45.08,62.7 IC1.4
~1
  Bottom 0.813: D4.A D6.C BU1.P2 BU1.P1
~2
  Bottom 0.406: 145.41,79.84 145.54,79.72 C9.-
  Bottom 0.813: D3.A D5.C 145.41,83.66 | 145.41,83.66 BU1.M | 145.41,83.66 145.41,79.84

### Text on the board
Top: 29 Brücken
Bottom: EPROM-Programmiergerät | HR ET LAB | http://www.hsch.at | http://s-hühn.de
Dimension: Die 3 Brücken unter dem TEXTOOL-Sockel werden auf der Lötseite bestückt. | Schaltung von Scott-Falk Hühn | Layout von H. Schönbauer
tPlace: 12V | 12,5V | 12.75V | 13V | 21,1V | 25,1V
tNames: R1 | R2 | R3 | R4 | R5